# Altium schematic sheet MCU2.SchDoc: MCU 2 - ESP32S3
size 420 x 297 mm; SheetNumber: 4; SheetTotal: 8
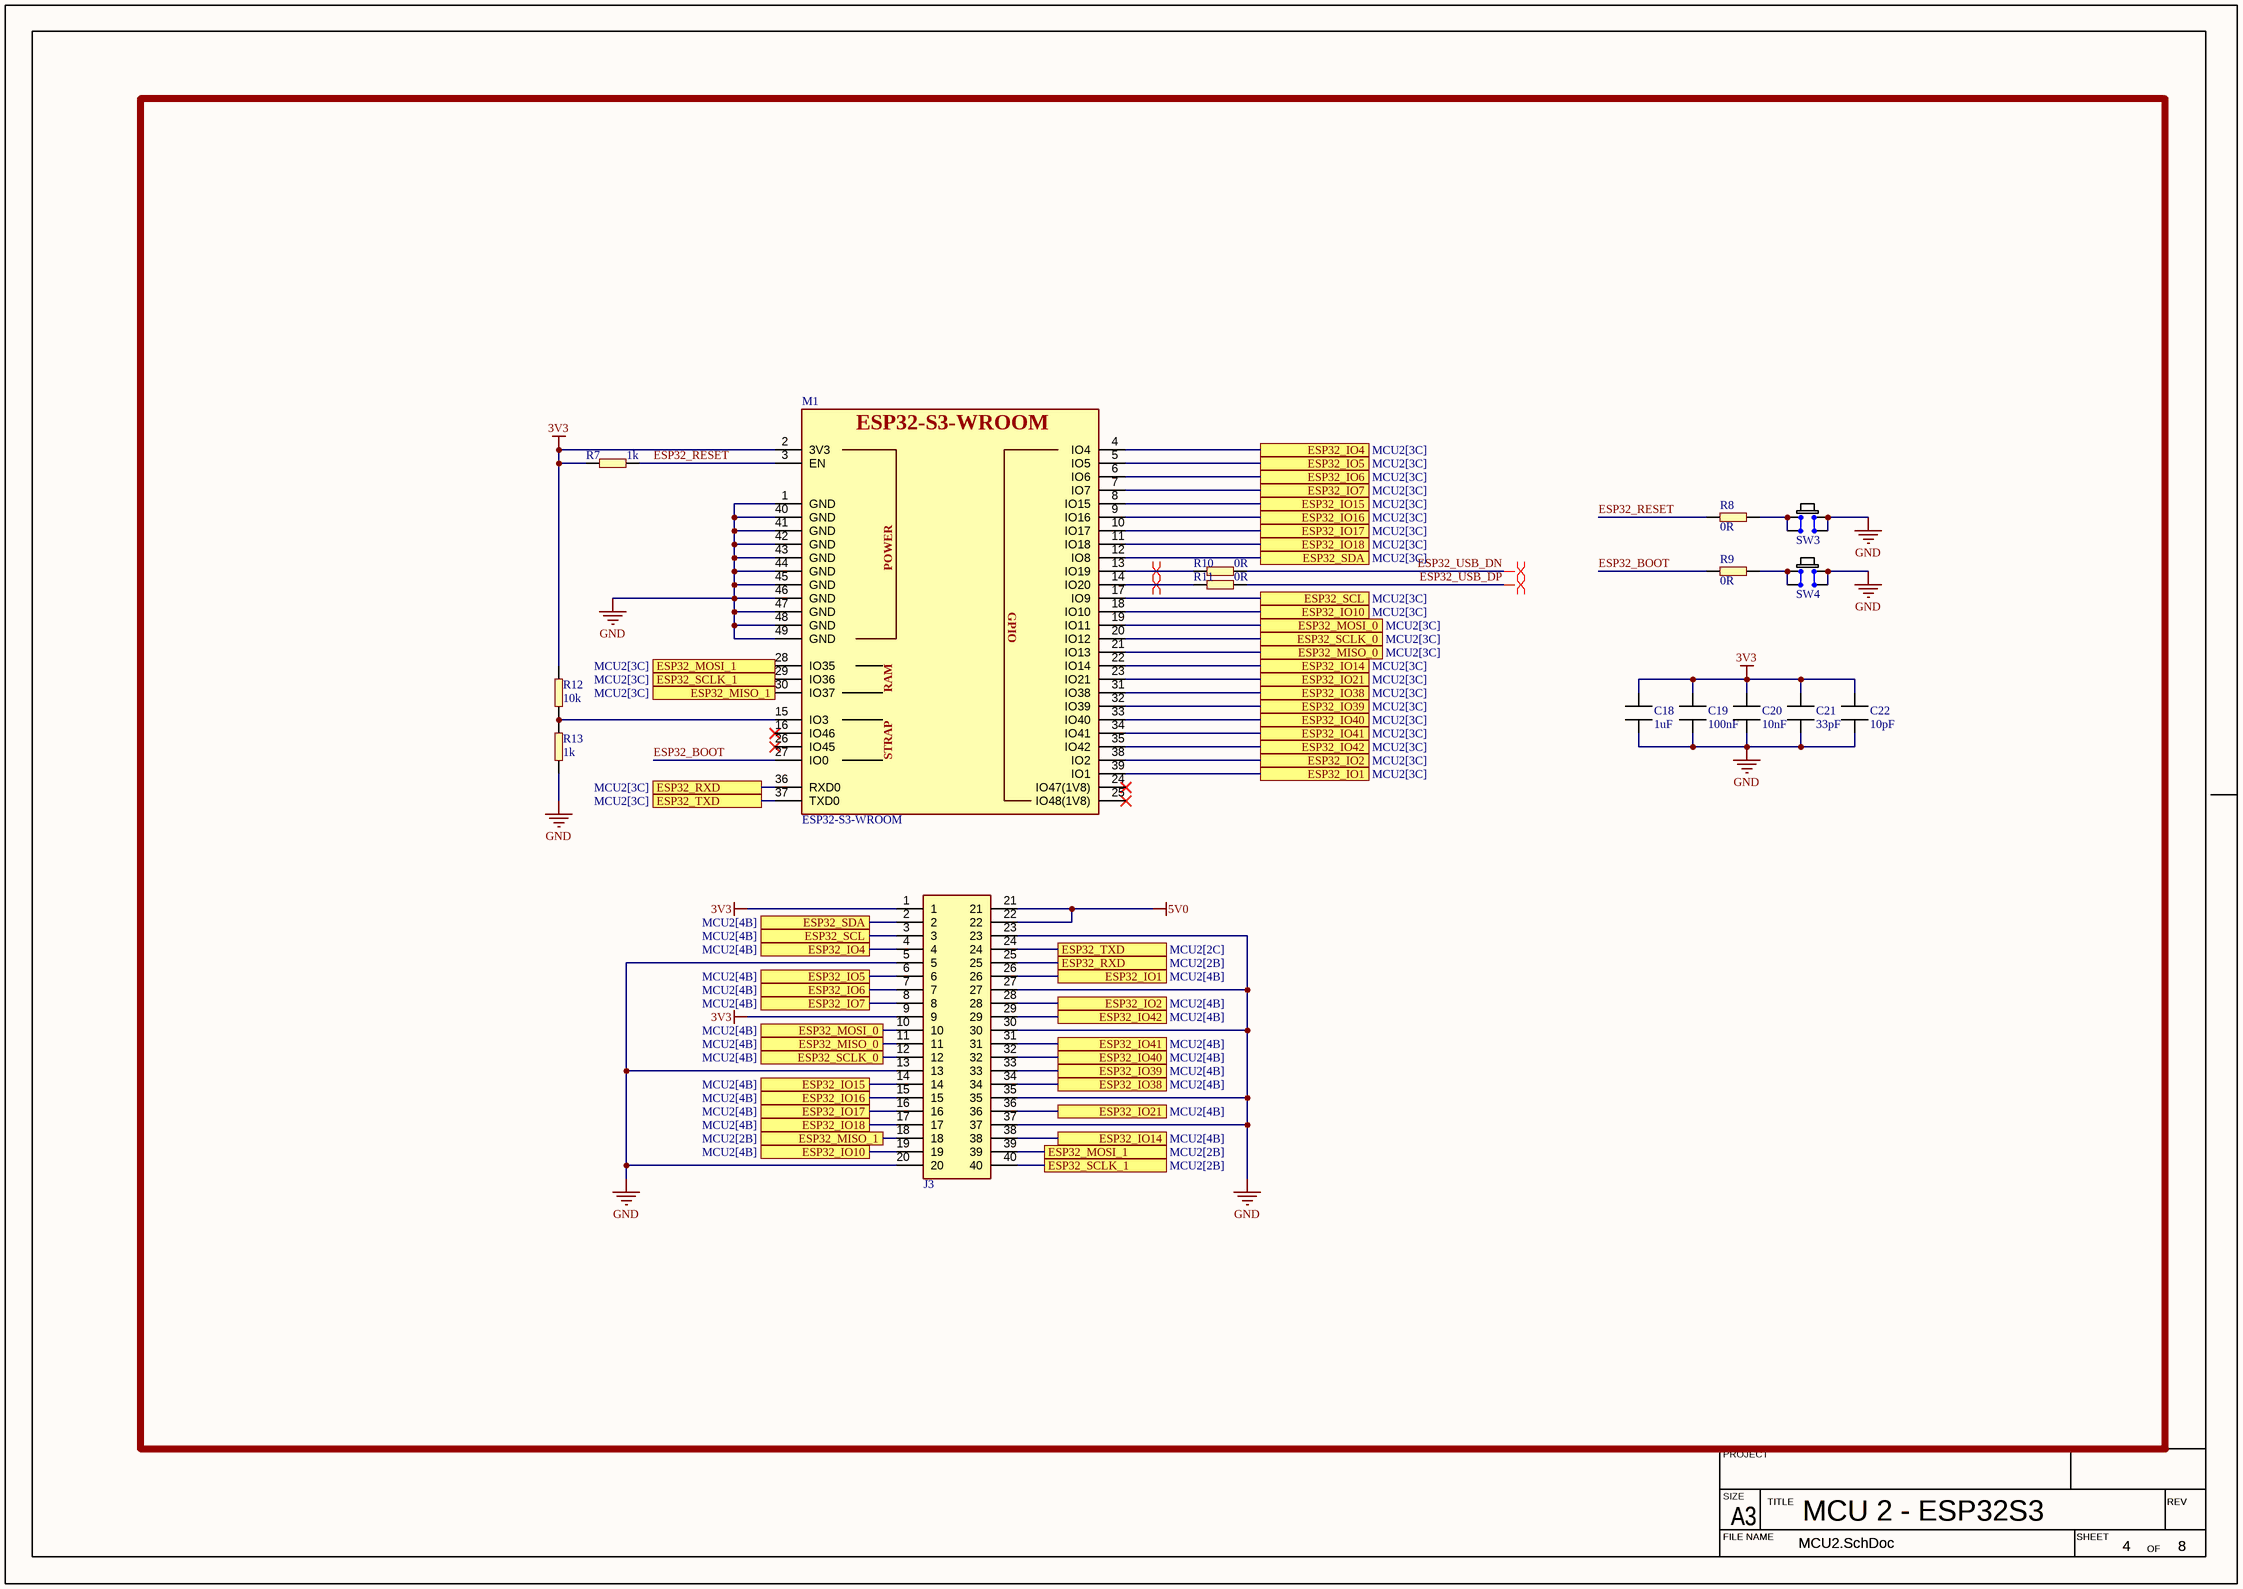
[diagram p0: MCU2.SchDoc]

## Parts
C18  value 1uF  [CAPC2012X13L]  (hidden comment: MLCC_0805)
C19  value 100nF  [CAPC2012X13L]  (hidden comment: MLCC_0805)
C20  value 10nF  [CAPC2012X13L]  (hidden comment: MLCC_0805)
C21  value 33pF  [CAPC2012X13L]  (hidden comment: MLCC_0805)
C22  value 10pF  [CAPC2012X13L]  (hidden comment: MLCC_0805)
J3  40PX2R_M_1  [40PX2R_Male_THT]  (value not drawn)
M1  ESP32-S3-WROOM  [ESP32-S3-WROOM-1U]
R7  value 1k  [RES_0805]  (hidden comment: ERP_101-1)
R8  value 0R  [RES_0805]  (hidden comment: ERP_101-1)
R9  value 0R  [RES_0805]  (hidden comment: ERP_101-1)
R10  value 0R  [RES_0805]  (hidden comment: ERP_101-1)
R11  value 0R  [RES_0805]  (hidden comment: ERP_101-1)
R12  value 10k  [RES_0805]  (hidden comment: ERP_101-1)
R13  value 1k  [RES_0805]  (hidden comment: ERP_101-1)
SW3  Generic6X6  [Generic6X6]  (value not drawn)
SW4  Generic6X6  [Generic6X6]  (value not drawn)

## Ports
ESP32_IO1 (see MCU2[3C]), ESP32_IO1 (see MCU2[4B]), ESP32_IO2 (see MCU2[3C]), ESP32_IO2 (see MCU2[4B]), ESP32_IO4 (see MCU2[3C]), ESP32_IO4 (see MCU2[4B]), ESP32_IO5 (see MCU2[3C]), ESP32_IO5 (see MCU2[4B]), ESP32_IO6 (see MCU2[3C]), ESP32_IO6 (see MCU2[4B]), ESP32_IO7 (see MCU2[3C]), ESP32_IO7 (see MCU2[4B]), ESP32_IO10 (see MCU2[3C]), ESP32_IO10 (see MCU2[4B]), ESP32_IO14 (see MCU2[3C]), ESP32_IO14 (see MCU2[4B]), ESP32_IO15 (see MCU2[3C]), ESP32_IO15 (see MCU2[4B]), ESP32_IO16 (see MCU2[3C]), ESP32_IO16 (see MCU2[4B]), ESP32_IO17 (see MCU2[3C]), ESP32_IO17 (see MCU2[4B]), ESP32_IO18 (see MCU2[3C]), ESP32_IO18 (see MCU2[4B]), ESP32_IO21 (see MCU2[3C]), ESP32_IO21 (see MCU2[4B]), ESP32_IO38 (see MCU2[3C]), ESP32_IO38 (see MCU2[4B]), ESP32_IO39 (see MCU2[3C]), ESP32_IO39 (see MCU2[4B]), ESP32_IO40 (see MCU2[3C]), ESP32_IO40 (see MCU2[4B]), ESP32_IO41 (see MCU2[3C]), ESP32_IO41 (see MCU2[4B]), ESP32_IO42 (see MCU2[3C]), ESP32_IO42 (see MCU2[4B]), ESP32_MISO_0 (see MCU2[3C]), ESP32_MISO_0 (see MCU2[4B]), ESP32_MISO_1 (see MCU2[2B]), ESP32_MISO_1 (see MCU2[3C]), ESP32_MOSI_0 (see MCU2[3C]), ESP32_MOSI_0 (see MCU2[4B]), ESP32_MOSI_1 (see MCU2[2B]), ESP32_MOSI_1 (see MCU2[3C]), ESP32_RXD (see MCU2[2B]), ESP32_RXD (see MCU2[3C]), ESP32_SCL (see MCU2[3C]), ESP32_SCL (see MCU2[4B]), ESP32_SCLK_0 (see MCU2[3C]), ESP32_SCLK_0 (see MCU2[4B]), ESP32_SCLK_1 (see MCU2[2B]), ESP32_SCLK_1 (see MCU2[3C]), ESP32_SDA (see MCU2[3C]), ESP32_SDA (see MCU2[4B]), ESP32_TXD (see MCU2[2C]), ESP32_TXD (see MCU2[3C])

## Nets
3V3: C18.1 C19.1 C20.1 C21.1 C22.1 J3.1 J3.9 M1.2(3V3) R7.2 R12.2
5V0: J3.21 J3.22
GND: C18.2 C19.2 C20.2 C21.2 C22.2 J3.5 J3.13 J3.20 J3.23 J3.27 J3.30 J3.35 J3.37 M1.1(GND) M1.40(GND) M1.41(GND) M1.42(GND) M1.43(GND) M1.44(GND) M1.45(GND) M1.46(GND) M1.47(GND) M1.48(GND) M1.49(GND) R13.2 SW3.3(COM) SW3.4(COM) SW4.3(COM) SW4.4(COM)
ESP32_BOOT: M1.27(IO0) R9.2
ESP32_IO1: J3.26 M1.39(IO1) ; port ESP32_IO1
ESP32_IO2: J3.28 M1.38(IO2) ; port ESP32_IO2
ESP32_IO4: J3.4 M1.4(IO4) ; port ESP32_IO4
ESP32_IO5: J3.6 M1.5(IO5) ; port ESP32_IO5
ESP32_IO6: J3.7 M1.6(IO6) ; port ESP32_IO6
ESP32_IO7: J3.8 M1.7(IO7) ; port ESP32_IO7
ESP32_IO10: J3.19 M1.18(IO10) ; port ESP32_IO10
ESP32_IO14: J3.38 M1.22(IO14) ; port ESP32_IO14
ESP32_IO15: J3.14 M1.8(IO15) ; port ESP32_IO15
ESP32_IO16: J3.15 M1.9(IO16) ; port ESP32_IO16
ESP32_IO17: J3.16 M1.10(IO17) ; port ESP32_IO17
ESP32_IO18: J3.17 M1.11(IO18) ; port ESP32_IO18
ESP32_IO21: J3.36 M1.23(IO21) ; port ESP32_IO21
ESP32_IO38: J3.34 M1.31(IO38) ; port ESP32_IO38
ESP32_IO39: J3.33 M1.32(IO39) ; port ESP32_IO39
ESP32_IO40: J3.32 M1.33(IO40) ; port ESP32_IO40
ESP32_IO41: J3.31 M1.34(IO41) ; port ESP32_IO41
ESP32_IO42: J3.29 M1.35(IO42) ; port ESP32_IO42
ESP32_MISO_0: J3.11 M1.21(IO13) ; port ESP32_MISO_0
ESP32_MISO_1: J3.18 M1.30(IO37) ; port ESP32_MISO_1
ESP32_MOSI_0: J3.10 M1.19(IO11) ; port ESP32_MOSI_0
ESP32_MOSI_1: J3.39 M1.28(IO35) ; port ESP32_MOSI_1
ESP32_RESET: M1.3(EN) R7.1 R8.2
ESP32_RXD: J3.25 M1.36(RXD0) ; port ESP32_RXD
ESP32_SCL: J3.3 M1.17(IO9) ; port ESP32_SCL
ESP32_SCLK_0: J3.12 M1.20(IO12) ; port ESP32_SCLK_0
ESP32_SCLK_1: J3.40 M1.29(IO36) ; port ESP32_SCLK_1
ESP32_SDA: J3.2 M1.12(IO8) ; port ESP32_SDA
ESP32_TXD: J3.24 M1.37(TXD0) ; port ESP32_TXD
ESP32_USB_DN: R10.1
ESP32_USB_DP: R11.1
NetM1_13: M1.13(IO19) R10.2
NetM1_14: M1.14(IO20) R11.2
NetM1_15: M1.15(IO3) R12.1 R13.1
NetR8_1: R8.1 SW3.1(NO) SW3.2(NO)
NetR9_1: R9.1 SW4.1(NO) SW4.2(NO)

Not connected (* = marked no-connect by the designer): M1 16(IO46)* 24(IO47(1V8))* 25(IO48(1V8))* 26(IO45)*

## Layout directives
differential pair; rule Differential Pairs Routing [Pref Gap = 31.496mil    Min Gap  = 31.496mil    Max Gap  = 31.496milPref Width = 10mil    Min Width  = 10mil    Max Width  = 10mil]: NetM1_13, NetM1_14
rule Differential Pairs Routing [Pref Gap = 31.496mil    Min Gap  = 31.496mil    Max Gap  = 31.496milPref Width = 10mil    Min Width  = 10mil    Max Width  = 10mil]: ESP32_USB_DN, ESP32_USB_DP

## Notes on the sheet
- PROJECT
- SIZE
- FILE NAME
- A3
- TITLE
- SHEET
- OF
- REV
- (in symbol ESP32-S3-WROOM) POWER; GPIO; RAM; STRAP

## Library data of the parts
C18-C22 = MLCC_0805: Chip Capacitor, 2-Leads, Body 2.00x1.25mm, IPC High Density; Package: 0805; Manufacturer 1: *; Manufacturer Part Number 1: *
J3 = 40PX2R_M_1: Berg Connector Header Through Hole  40 Position 0.100" (2.54mm); Manufacturer 1: CNC Tech; Value: *; Manufacturer Part Number 1: *
M1 = ESP32-S3-WROOM: ESP32-S3-WROOM Module; Manufacturer 1: Espressif Systems; Manufacturer Part Number 1: *; Package: *; Value: ESP32-S3-WROOM
R7-R13 = RES_0805: Package: 0805; Manufacturer 1: *; Manufacturer Part Number 1: *
SW3 SW4 = Generic6X6: Tactile Switch SPST-NO Top Actuated Surface Mount; Manufacturer 1: C&K; Manufacturer Part Number 1: *; Package: 4.5X4.5